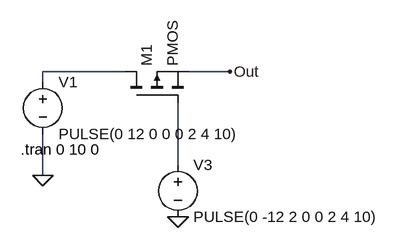
[diagram p0: schematic Transistor reverse polarity protection.asc]
Transistor reverse polarity protection.asc, the LTspice schematic file:
Version 4
SHEET 1 880 14184
WIRE -2880 13568 -3008 13568
WIRE -2720 13568 -2784 13568
WIRE -3008 13584 -3008 13568
WIRE -2800 13712 -2800 13616
WIRE -3008 13728 -3008 13664
FLAG -3008 13728 0
FLAG -2800 13792 0
FLAG -2720 13568 Out
SYMBOL pmos -2880 13616 R270
SYMATTR InstName M1
SYMBOL voltage -3008 13568 R0
WINDOW 123 0 0 Left 0
WINDOW 39 0 0 Left 0
SYMATTR InstName V1
SYMATTR Value PULSE(0 12 0 0 0 2 4 10)
SYMBOL voltage -2800 13696 R0
WINDOW 123 0 0 Left 0
WINDOW 39 0 0 Left 0
SYMATTR InstName V3
SYMATTR Value PULSE(0 -12 2 0 0 2 4 10)
TEXT -3042 13688 Left 2 !.tran 0 10 0

The netlist it stands for:
* Transistor reverse polarity protection.asc
M1 N001 N002 Out Out PMOS
V1 N001 0 PULSE(0 12 0 0 0 2 4 10)
V3 N002 0 PULSE(0 -12 2 0 0 2 4 10)
.model NMOS NMOS
.model PMOS PMOS
.lib standard.mos
.tran 0 10 0
.backanno
.end